# Altium schematic sheet LEDdriver-LT3518.SchDoc
size A4
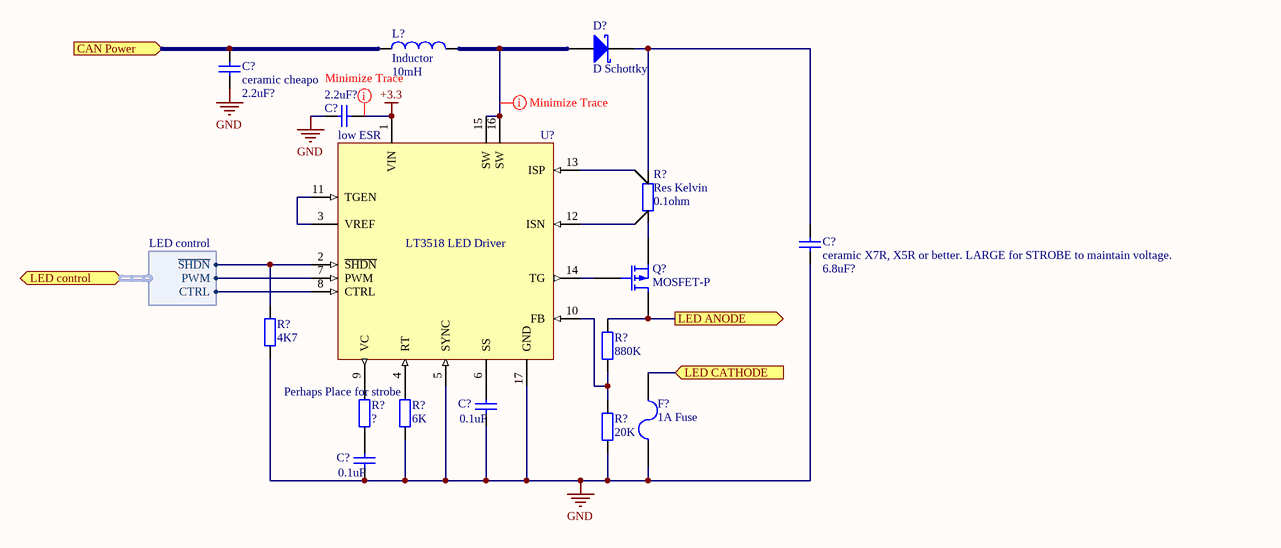
[diagram p0: LEDdriver-LT3518.SchDoc]

## Parts
(Parts that share a designator on the sheet are numbered #1, #2 ... from top to bottom, then left to right.)
C?#1  ceramic cheapo  value 2.2uF?  [RAD-0.3]
C?#2  low ESR  value 2.2uF?  [RAD-0.3]
C?#3  ceramic X7R, X5R or better. LARGE for STROBE to maintain voltage.  value 6.8uF?  [RAD-0.3]
C?#4  value 0.1uF  [RAD-0.3]  (hidden comment: Cap)
C?#5  value 0.1uF  [RAD-0.3]  (hidden comment: Cap)
D?  D Schottky  [DSO-C2/X2.3]
F?  1A Fuse  [PIN-W2/E2.8]
L?  Inductor  value 10mH  [INDC1005AL]
Q?  MOSFET-P  [BCY-W3/B.8]
R?#1  Res Kelvin  value 0.1ohm
R?#2  value 4K7  [R0603]  (hidden comment: Res)
R?#3  value 880K  [R0603]  (hidden comment: Res)
R?#4  Perhaps Place for strobe  [R0603]
R?#5  value 6K  [R0603]  (hidden comment: Res)
R?#6  value 20K  [R0603]  (hidden comment: Res)
U?  LT3518 LED Driver  [TSOP65P640X110_HS-16N]

## Ports
CAN Power (in), LED ANODE (out), LED CATHODE (in), LED control (harness LED control)

## Harnesses
LED control: ~{SHDN}, PWM, CTRL

## Nets
+3.3: C?#2.1 U?.1(VIN)
GND: C?#1.2 C?#2.2 C?#3.2 C?#4.1 C?#5.1 F?.2 R?#2.1 R?#5.1 R?#6.1 U?.5(SYNC) U?.17(GND)
CAN Power: C?#1.1 L?.1 ; port CAN Power
LED ANODE: Q?.1(D) R?#3.2 ; port LED ANODE
LED CATHODE: F?.1 ; port LED CATHODE
NetC?#3_1: C?#3.1 D?.2(K) R?#1.2
NetC?#4_2: C?#4.2 U?.6(SS)
NetC?#5_2: C?#5.2 R?#4.1
NetD?_1: D?.1(A) L?.2 U?.15(SW) U?.16(SW)
NetQ?_2: Q?.2(G) U?.14(TG)
NetQ?_3: Q?.3(S) R?#1.1
NetR?#1_3: R?#1.3 U?.12(ISN)
NetR?#1_4: R?#1.4 U?.13(ISP)
NetR?#2_2: R?#2.2 U?.2(~{SHDN}) ; port LED control.~{SHDN}
NetR?#3_1: R?#3.1 R?#6.2 U?.10(FB)
NetR?#4_2: R?#4.2 U?.9(VC)
NetR?#5_2: R?#5.2 U?.4(RT)
NetU?_3: U?.3(VREF) U?.11(TGEN)
NetU?_7: U?.7(PWM) ; port LED control.PWM
NetU?_8: U?.8(CTRL) ; port LED control.CTRL

## Layout directives
rule Length Constraint [Min Length = 0mil    Max Length = 10mil]: +3.3, NetD?_1

## Library data of the parts
C?#1-C?#5 = Cap: Capacitor; Published: 8-Jun-2000; LatestRevisionDate: 17-Jul-2002; LatestRevisionNote: Re-released for DXP Platform.; PackageReference: RAD-0.3; Publisher: Altium Limited
D? = D Schottky: Schottky Diode; Published: 8-Jun-2000; LatestRevisionDate: 17-Jul-2002; LatestRevisionNote: Re-released for DXP Platform.; PackageReference: SMB; Publisher: Altium Limited; Code_JEDEC: DO-214-AA
F? = Fuse 2: Fuse; Published: 8-Jun-2000; LatestRevisionDate: 17-Jul-2002; LatestRevisionNote: Re-released for DXP Platform.; PackageReference: PIN-W2/E2.8; Publisher: Altium Limited
L? = Inductor: Code_IEC: 1005; Published: 8-Jun-2000; LatestRevisionDate: 29-May-2009; LatestRevisionNote: IPC-7351 Footprint Added.; PackageReference: 0402-A; Publisher: Altium Limited; PackageDescription: Chip Inductor; Code_JEITA: 0402
Q? = MOSFET-P: P-Channel MOSFET; Published: 8-Jun-2000; LatestRevisionDate: 17-Jul-2002; LatestRevisionNote: Re-released for DXP Platform.; PackageVersion: 1995/1996; PackageReference: E3; Publisher: Altium Limited
R?#1 = Res Kelvin: Resistor Kelvin; Published: 8-Jun-2000; LatestRevisionDate: 17-Jul-2002; LatestRevisionNote: Re-released for DXP Platform.; PackageReference: AXIAL-0.4; Publisher: Altium Limited
R?#2-R?#6 = Res2: Resistor; farnell: 9330607
  R?#4: Value: ?
U? = LT3518: LT3518 Full-Featured LED Driver  with 2.3A Switch Current